# Altium schematic sheet power.SchDoc
size A4; SheetNumber: 5; SheetTotal: 7
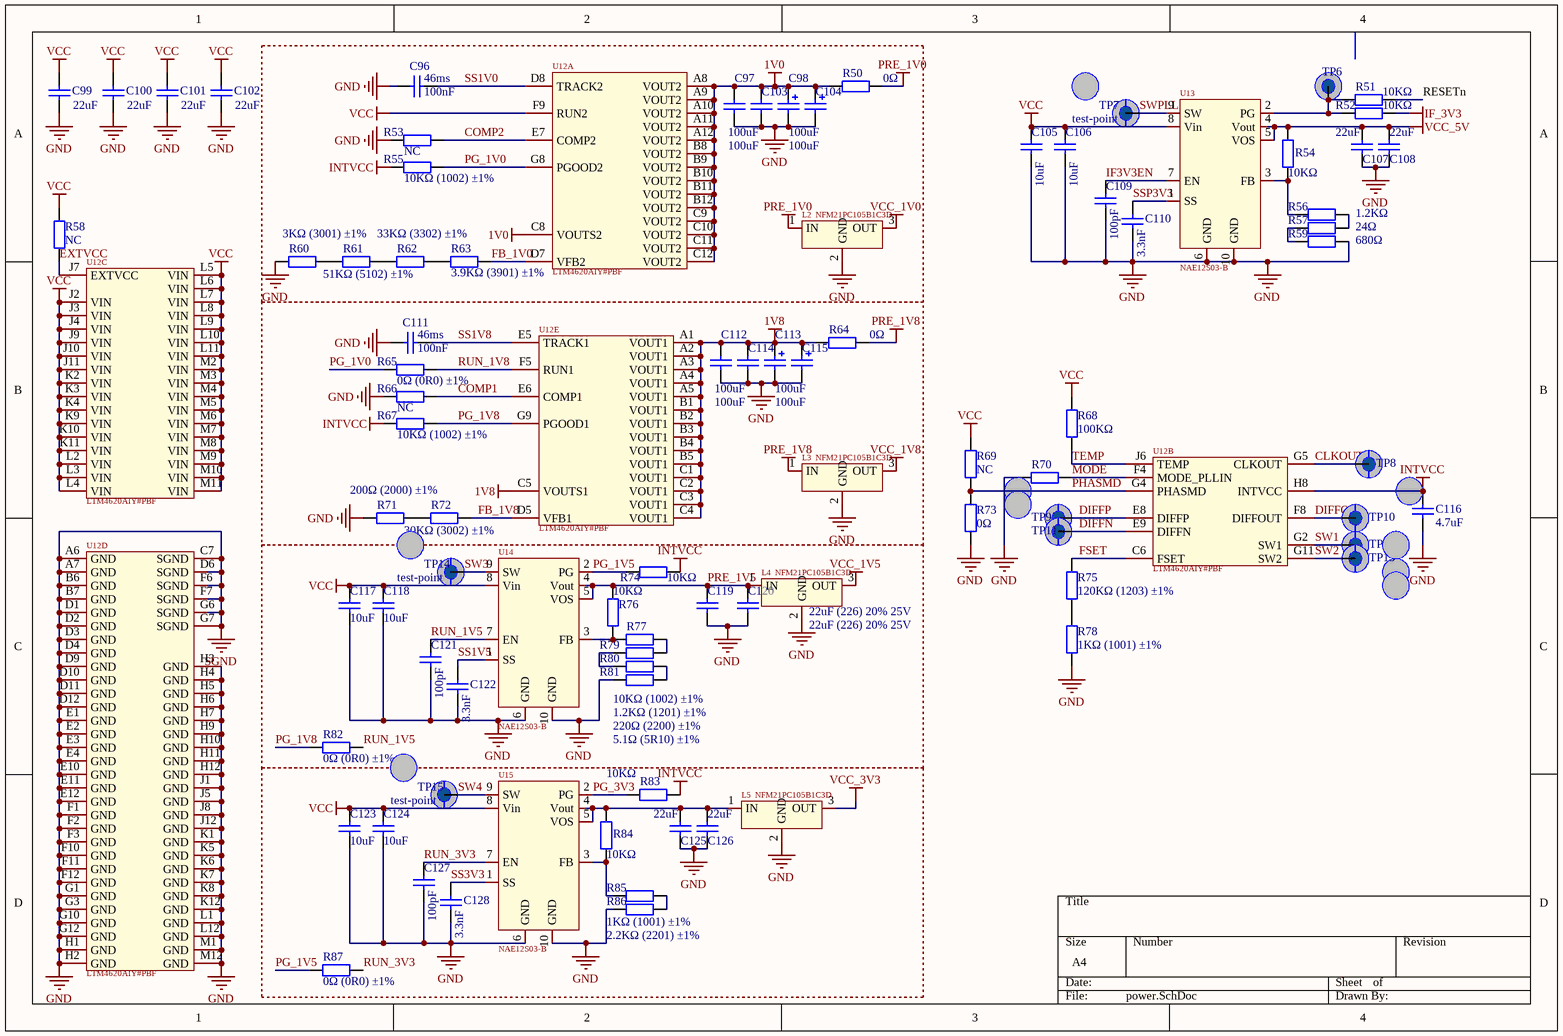
[diagram p0: power.SchDoc]

## Parts
C96  100nF  [0805_C]
C97  100uF  [1206_C]
C98  100uF  [CASE-B_3528]
C99  22uF  [0805_C]
C100  22uF  [0805_C]
C101  22uF  [0805_C]
C102  22uF  [0805_C]
C103  100uF  [1206_C]
C104  100uF  [CASE-B_3528]
C105  10uF  [0805_C]
C106  10uF  [0805_C]
C107  22uF  [0805_C]
C108  22uF  [0805_C]
C109  100pF  [0805_C]
C110  3.3nF  [0805_C]
C111  100nF  [0805_C]
C112  100uF  [1206_C]
C113  100uF  [CASE-B_3528]
C114  100uF  [1206_C]
C115  100uF  [CASE-B_3528]
C116  4.7uF  [0805_C]
C117  10uF  [0805_C]
C118  10uF  [0805_C]
C119  22uF (226) 20% 25V  [0805_C]
C120  22uF (226) 20% 25V  [0805_C]
C121  100pF  [0805_C]
C122  3.3nF  [0805_C]
C123  10uF  [0805_C]
C124  10uF  [0805_C]
C125  22uF  [0805_C]
C126  22uF  [0805_C]
C127  100pF  [0805_C]
C128  3.3nF  [0805_C]
L2  NFM21PC105B1C3D  [FILTER-SMD_3P-L2.0-W1.2-L]
L3  NFM21PC105B1C3D  [FILTER-SMD_3P-L2.0-W1.2-L]
L4  NFM21PC105B1C3D  [FILTER-SMD_3P-L2.0-W1.2-L]
L5  NFM21PC105B1C3D  [FILTER-SMD_3P-L2.0-W1.2-L]
R50  0Ω  [0402_R]
R51  10KΩ  [0805_R]
R52  10KΩ  [0805_R]
R53  NC  [0805_R]
R54  10KΩ  [0805_R]
R55  10KΩ (1002) ±1%  [0805_R]
R56  1.2KΩ  [0805_R]
R57  24Ω  [0805_R]
R58  NC  [0805_R]
R59  680Ω  [0805_R]
R60  3KΩ (3001) ±1%  [0805_R]
R61  51KΩ (5102) ±1%  [0805_R]
R62  33KΩ (3302) ±1%  [0805_R]
R63  3.9KΩ (3901) ±1%  [0805_R]
R64  0Ω  [0402_R]
R65  0Ω (0R0) ±1%  [0805_R]
R66  NC  [0805_R]
R67  10KΩ (1002) ±1%  [0805_R]
R68  100KΩ  [0805_R]
R69  NC  [0805_R]
R70  0Ω  [0805_R]
R71  200Ω (2000) ±1%  [0805_R]
R72  30KΩ (3002) ±1%  [0805_R]
R73  0Ω  [0805_R]
R74  10KΩ  [0805_R]
R75  120KΩ (1203) ±1%  [0805_R]
R76  10KΩ  [0805_R]
R77  10KΩ (1002) ±1%  [0805_R]
R78  1KΩ (1001) ±1%  [0805_R]
R79  1.2KΩ (1201) ±1%  [0805_R]
R80  220Ω (2200) ±1%  [0805_R]
R81  5.1Ω (5R10) ±1%  [0805_R]
R82  0Ω (0R0) ±1%  [0805_R]
R83  10KΩ  [0805_R]
R84  10KΩ  [0805_R]
R85  2.2KΩ (2201) ±1%  [0805_R]
R86  1KΩ (1001) ±1%  [0805_R]
R87  0Ω (0R0) ±1%  [0805_R]
TP6  test-point  [POINT]  (value not drawn)
TP7  test-point  [POINT]
TP8  test-point  [POINT]  (value not drawn)
TP9  test-point  [POINT]  (value not drawn)
TP10  test-point  [POINT]  (value not drawn)
TP11  test-point  [POINT]  (value not drawn)
TP12  test-point  [POINT]  (value not drawn)
TP13  test-point  [POINT]  (value not drawn)
TP14  test-point  [POINT]
TP15  test-point  [POINT]
U12  LTM4620AIY#PBF  [BGA-144_L15.0-W15.0-R12-C12-P1.27-BL]  (parts A,B,C,D,E of 5)
U13  NAE12S03-B  [PWRM-SMD_HUAWEI_NAE12S03]
U14  NAE12S03-B  [PWRM-SMD_HUAWEI_NAE12S03]
U15  NAE12S03-B  [PWRM-SMD_HUAWEI_NAE12S03]

## Blocks framed on the sheet
46ms: C96-C98 C103 C104 L2 R50 R53 R55 R60-R63 U12
46ms: C111-C115 L3 R64-R67 R71 R72 U12

## Nets
1V0: C97.2 C98.1 C103.2 C104.1 R50.1 U12.A8(VOUT2) U12.A9(VOUT2) U12.A10(VOUT2) U12.A11(VOUT2) U12.A12(VOUT2) U12.B8(VOUT2) U12.B9(VOUT2) U12.B10(VOUT2) U12.B11(VOUT2) U12.B12(VOUT2) U12.C8(VOUTS2) U12.C9(VOUT2) U12.C10(VOUT2) U12.C11(VOUT2) U12.C12(VOUT2)
1V8: C112.2 C113.1 C114.2 C115.1 R64.1 U12.A1(VOUT1) U12.A2(VOUT1) U12.A3(VOUT1) U12.A4(VOUT1) U12.A5(VOUT1) U12.B1(VOUT1) U12.B2(VOUT1) U12.B3(VOUT1) U12.B4(VOUT1) U12.B5(VOUT1) U12.C1(VOUT1) U12.C2(VOUT1) U12.C3(VOUT1) U12.C4(VOUT1) U12.C5(VOUTS1)
GND: C96.2 C97.1 C98.2 C99.1 C100.1 C101.1 C102.1 C103.1 C104.2 C105.1 C106.1 C107.1 C108.1 C109.1 C110.1 C111.2 C112.1 C113.2 C114.1 C115.2 C116.1 C117.1 C118.1 C119.1 C120.1 C121.1 C122.1 C123.1 C124.1 C125.1 C126.1 C127.1 C128.1 L2.2(GND) L3.2(GND) L4.2(GND) L5.2(GND) R53.1 R59.2 R60.2 R66.1 R70.2 R71.1 R73.1 R78.1 R81.2 R86.2 U12.A6(GND) U12.A7(GND) U12.B6(GND) U12.B7(GND) U12.C7(SGND) U12.D1(GND) U12.D2(GND) U12.D3(GND) U12.D4(GND) U12.D6(SGND) U12.D9(GND) U12.D10(GND) U12.D11(GND) U12.D12(GND) U12.E1(GND) U12.E2(GND) U12.E3(GND) U12.E4(GND) U12.E10(GND) U12.E11(GND) U12.E12(GND) U12.F1(GND) U12.F2(GND) U12.F3(GND) U12.F6(SGND) U12.F7(SGND) U12.F10(GND) U12.F11(GND) U12.F12(GND) U12.G1(GND) U12.G3(GND) U12.G6(SGND) U12.G7(SGND) U12.G10(GND) U12.G12(GND) U12.H1(GND) U12.H2(GND) U12.H3(GND) U12.H4(GND) U12.H5(GND) U12.H6(GND) U12.H7(GND) U12.H9(GND) U12.H10(GND) U12.H11(GND) U12.H12(GND) U12.J1(GND) U12.J5(GND) U12.J8(GND) U12.J12(GND) U12.K1(GND) U12.K5(GND) U12.K6(GND) U12.K7(GND) U12.K8(GND) U12.K12(GND) U12.L1(GND) U12.L12(GND) U12.M1(GND) U12.M12(GND) U13.6(GND) U13.10(GND) U14.6(GND) U14.10(GND) U15.6(GND) U15.10(GND)  [also labelled SGND]
IF_3V3: R52.1
INTVCC: C116.2 R55.2 R67.2 R74.2 R83.2 U12.H8(INTVCC)
PRE_1V0: L2.1(IN) R50.2
PRE_1V8: L3.1(IN) R64.2
VCC: C99.2 C100.2 C101.2 C102.2 C105.2 C106.2 C117.2 C118.2 C123.2 C124.2 R58.1 R68.2 R69.2 U12.F9(RUN2) U12.J2(VIN) U12.J3(VIN) U12.J4(VIN) U12.J9(VIN) U12.J10(VIN) U12.J11(VIN) U12.K2(VIN) U12.K3(VIN) U12.K4(VIN) U12.K9(VIN) U12.K10(VIN) U12.K11(VIN) U12.L2(VIN) U12.L3(VIN) U12.L4(VIN) U12.L5(VIN) U12.L6(VIN) U12.L7(VIN) U12.L8(VIN) U12.L9(VIN) U12.L10(VIN) U12.L11(VIN) U12.M2(VIN) U12.M3(VIN) U12.M4(VIN) U12.M5(VIN) U12.M6(VIN) U12.M7(VIN) U12.M8(VIN) U12.M9(VIN) U12.M10(VIN) U12.M11(VIN) U13.8(Vin) U14.8(Vin) U15.8(Vin)
VCC_1V0: L2.3(OUT)
VCC_1V5: L4.3(OUT)
VCC_1V8: L3.3(OUT)
VCC_3V3: L5.3(OUT)
VCC_5V: C107.2 C108.2 R54.2 U13.4(Vout) U13.5(VOS)
CLKOUT: TP8.1(point) U12.G5(CLKOUT)
COMP1: R66.2 U12.E6(COMP1)
COMP2: R53.2 U12.E7(COMP2)
DIFFN: TP11.1(point) U12.E9(DIFFN)
DIFFO: TP10.1(point) U12.F8(DIFFOUT)
DIFFP: TP9.1(point) U12.E8(DIFFP)
EXTVCC: R58.2 U12.J7(EXTVCC)
FB_1V0: R63.2 U12.D7(VFB2)
FB_1V8: R72.2 U12.D5(VFB1)
FSET: R75.2 U12.C6(FSET)
IF3V3EN: C109.2 U13.7(EN)
MODE: R70.1 U12.F4(MODE_PLLIN)
PG_1V0: R55.1 R65.2 U12.G8(PGOOD2)
PG_1V5: R74.1 R87.2 U14.2(PG)
PG_1V8: R67.1 R82.2 U12.G9(PGOOD1)
PG_3V3: R83.1 U15.2(PG)
PHASMD: R69.1 R73.2 U12.G4(PHASMD)
PRE_1V5: C119.2 C120.2 L4.1(IN) R76.2 U14.4(Vout) U14.5(VOS)
RESETn: R51.1
RUN_1V5: C121.2 R82.1 U14.7(EN)
RUN_1V8: R65.1 U12.F5(RUN1)
RUN_3V3: C127.2 R87.1 U15.7(EN)
SS1V0: C96.1 U12.D8(TRACK2)
SS1V5: C122.2 U14.1(SS)
SS1V8: C111.1 U12.E5(TRACK1)
SS3V3: C128.2 U15.1(SS)
SSP3V3: C110.2 U13.1(SS)
SW1: TP12.1(point) U12.G2(SW1)
SW2: TP13.1(point) U12.G11(SW2)
SW3: TP14.1(point) U14.9(SW)
SW4: TP15.1(point) U15.9(SW)
SWPLL: TP7.1(point) U13.9(SW)
TEMP: R68.1 U12.J6(TEMP)
NetC125_2: C125.2 C126.2 L5.1(IN) R84.2 U15.4(Vout) U15.5(VOS)
NetR51_2: R51.2 R52.2 TP6.1(point) U13.2(PG)
NetR54_1: R54.1 R56.1 U13.3(FB)
NetR56_2: R56.2 R57.2
NetR57_1: R57.1 R59.1
NetR60_1: R60.1 R61.1
NetR61_2: R61.2 R62.1
NetR62_2: R62.2 R63.1
NetR71_2: R71.2 R72.1
NetR75_1: R75.1 R78.2
NetR76_1: R76.1 R77.1 U14.3(FB)
NetR77_2: R77.2 R79.1
NetR79_2: R79.2 R80.2
NetR80_1: R80.1 R81.1
NetR84_1: R84.1 R85.1 U15.3(FB)
NetR85_2: R85.2 R86.1

## Library data of the parts
C96 C111 = 0805 100nF(104) 10% 50V: 贴片电容; ComponentLink1Description: 供应商链接; ComponentLink1URL: http://www.szlcsc.com/product/details_50686.html; Package: 0805; Supplier: LC; SuppliersPartNumber: C49678
C97 C103 C112 C114 = 1206 100nF (104) 10% 50V: 贴片电容; ComponentLink1Description: 供应商链接; ComponentLink1URL: http://www.szlcsc.com/product/details_25237.html; Package: 1206; Supplier: LC; SuppliersPartNumber: C24497
C98 C104 C113 C115 = 3528 100uF (107) 10% 6.3V: 钽电容; ComponentLink1Description: 供应商链接; ComponentLink1URL: http://www.szlcsc.com/product/details_16815.html; Package: 3528; Supplier: LC; SuppliersPartNumber: C16133
C99-C102 C107 C108 C119 C120 C125 C126 = 0805 22uF (226) 20% 25V: 贴片电容; ComponentLink1Description: 供应商链接; ComponentLink1URL: http://www.szlcsc.com/product/details_46786.html; Package: 0805; Supplier: LC; SuppliersPartNumber: C45783
C105 C106 C117 C118 C123 C124 = 0805 10uF (106) 10% 25V: 贴片电容; ComponentLink1Description: 供应商链接; ComponentLink1URL: http://www.szlcsc.com/product/details_16532.html; Package: 0805; Supplier: LC; SuppliersPartNumber: C15850
C109 C121 C127 = 0805 100pF (101) 5% 50V: 贴片电容; ComponentLink1Description: 供应商链接; ComponentLink1URL: http://www.szlcsc.com/product/details_2142.html; Package: 0805; Supplier: LC; SuppliersPartNumber: C1790
C110 C122 C128 = 0805 3.3nF (332) 10% 50V: 贴片电容; ComponentLink1Description: 供应商链接; ComponentLink1URL: http://www.szlcsc.com/product/details_54191.html; Package: 0805; Supplier: LC; SuppliersPartNumber: C53175
C116 = 0805 4.7uF (475) 10% 25V: 贴片电容; ComponentLink1Description: 供应商链接; ComponentLink1URL: http://www.szlcsc.com/product/details_2131.html; Package: 0805; Supplier: LC; SuppliersPartNumber: C1779
L2-L5 = NFM21PC105B1C3D: 穿心电容; Manufacturer: muRata(村田); Add into BOM: yes; Nominal Capacitance: 1uF; CapacitanceTolerance: ±20%; DC Rated Voltage: 16V; Rated Current: 4A; DC Resistance: 20mΩ; Symbol: NFM21PC105B1C3D; Device: NFM21PC105B1C3D; LCSC Part Name: 1.0uF(105) ±20%16V; Supplier Part: C92518; Manufacturer Part: NFM21PC105B1C3D; Supplier Footprint: SMD-3P,1.2x2mm; JLCPCB Part Class: Extended Part; Datasheet: https://atta.szlcsc.com/upload/public/pdf/source/20170105/1483610797228.pdf; Supplier: LCSC; Convert to PCB: yes; Operating Temperature: -40℃~+85℃
R50 R64 R65 R69 R70 R73 R82 R87 = 0805 0Ω (0R0) 1%: 贴片电阻; ComponentLink1Description: 供应商链接; ComponentLink1URL: http://www.szlcsc.com/product/details_18165.html; Package: 0805; Supplier: LC; SuppliersPartNumber: C17477
R51 R52 R54 R55 R67 R74 R76 R77 R83 R84 = 0805 10KΩ (1002) 1%: 贴片电阻; ComponentLink1Description: 供应商链接; ComponentLink1URL: http://www.szlcsc.com/product/details_18102.html; Package: 0805; Supplier: LC; SuppliersPartNumber: C17414
R53 R62 R66 R72 = 0805 33KΩ (3302) 1%: 贴片电阻; ComponentLink1Description: 供应商链接; ComponentLink1URL: http://www.szlcsc.com/product/details_18321.html; Package: 0805; Supplier: LC; SuppliersPartNumber: C17633
R56 R85 = 0805 2.2KΩ (2201) 1%: 贴片电阻; ComponentLink1Description: 供应商链接; ComponentLink1URL: http://www.szlcsc.com/product/details_18208.html; Package: 0805; Supplier: LC; SuppliersPartNumber: C17520
R57 R59 R86 = 0805 1KΩ (1001) 1%: 贴片电阻; ComponentLink1Description: 供应商链接; ComponentLink1URL: http://www.szlcsc.com/product/details_18201.html; Package: 0805; Supplier: LC; SuppliersPartNumber: C17513
R58 R60 = 0805 3KΩ (3001) 1%: 贴片电阻; ComponentLink1Description: 供应商链接; ComponentLink1URL: http://www.szlcsc.com/product/details_18349.html; Package: 0805; Supplier: LC; SuppliersPartNumber: C17661
R61 = 0805 51KΩ (5102) 1%: 贴片电阻; ComponentLink1Description: 供应商链接; ComponentLink1URL: http://www.szlcsc.com/product/details_18425.html; Package: 0805; Supplier: LC; SuppliersPartNumber: C17737
R63 = 0805 3.9KΩ (3901) 1%: 贴片电阻; ComponentLink1Description: 供应商链接; ComponentLink1URL: http://www.szlcsc.com/product/details_18302.html; Package: 0805; Supplier: LC; SuppliersPartNumber: C17614
R68 = 0805 100KΩ (1003) 1%: 贴片电阻; ComponentLink1Description: 供应商链接; ComponentLink1URL: http://www.szlcsc.com/product/details_18095.html; Package: 0805; Supplier: LC; SuppliersPartNumber: C17407
R71 = 0805 200Ω (2000) 1%: 贴片电阻; ComponentLink1Description: 供应商链接; ComponentLink1URL: http://www.szlcsc.com/product/details_18228.html; Package: 0805; Supplier: LC; SuppliersPartNumber: C17540
R75 = 0402 120KΩ (1203) 1%: 贴片电阻; ComponentLink1Description: 供应商链接; ComponentLink1URL: http://www.szlcsc.com/product/details_26493.html; Package: 0402; Supplier: LC; SuppliersPartNumber: C25750
R78 = 0402 1KΩ (1001) 1%: 贴片电阻; ComponentLink1Description: 供应商链接; ComponentLink1URL: http://www.szlcsc.com/product/details_12256.html; Package: 0402; Supplier: LC; SuppliersPartNumber: C11702
R79 = 0805 1.2KΩ (1201) 1%: 贴片电阻; ComponentLink1Description: 供应商链接; ComponentLink1URL: http://www.szlcsc.com/product/details_18067.html; Package: 0805; Supplier: LC; SuppliersPartNumber: C17379
R80 = 0805 220Ω (2200) 1%: 贴片电阻; ComponentLink1Description: 供应商链接; ComponentLink1URL: http://www.szlcsc.com/product/details_18245.html; Package: 0805; Supplier: LC; SuppliersPartNumber: C17557
R81 = 0805 5.1Ω (5R10) 1%: 贴片电阻; ComponentLink1Description: 供应商链接; ComponentLink1URL: http://www.szlcsc.com/product/details_18412.html; Package: 0805; Supplier: LC; SuppliersPartNumber: C17724
TP6-TP15 = test-point: 测试点
U12 = LTM4620AIY#PBF: ADI电源; Manufacturer: ADI(亚德诺); Add into BOM: yes; Conversion Type: DC-DC; Input Voltage(DC): 4.5V~16V; Output Voltage: 0.6V~5.3V; Output Current (Max): 13A; Output Channel: 2; Symbol: LTM4620AIY#PBF; Device: LTM4620AIY#PBF; LCSC Part Name: 双通道 13A 或单通道 26A DC/DC uModule 稳压器; Supplier Part: C108015; Manufacturer Part: LTM4620AIY#PBF; Supplier Footprint: BGA-144(15x15); JLCPCB Part Class: Extended Part; Datasheet: https://atta.szlcsc.com/upload/public/pdf/source/20191223/C471410_9980ECA8DA2BC0F921CA49592D580556.pdf; Supplier: LCSC; Convert to PCB: yes; Output Power: -; Insulated Voltage: -; Conversion Efficiency: -; Feature: 过压保护；欠压保护；过流保护; Maximum Capacitive Load: -
U13-U15 = NAE12S03-B: 华为电源模块; Manufacturer: HUAWEI(华为); Add into BOM: yes; Conversion Type: DC-DC; Input Voltage(DC): 6.3V~14V; Output Voltage: 0.8V~5.2V; Output Power: 15W; Output Current (Max): 3A; Output Channel: 1; Maximum Capacitive Load: 500uF; Symbol: NAE12S03-B; Device: NAE12S03-B; LCSC Part Name: NAE12S03-B; Supplier Part: C5632472; Manufacturer Part: NAE12S03-B; Supplier Footprint: -; JLCPCB Part Class: Extended Part; Datasheet: https://atta.szlcsc.com/upload/public/pdf/source/20230428/342BA0ED97D448F86BA8DB326342F56D.pdf; Supplier: LCSC; Convert to PCB: yes